# EasyEDA Pro project ProPrj_Micro-Profilometer_2025-09-25.epro, schematic Schematic1
Board Name: Board1; Create Date: 2025-07-30; Page Name: P1; Project Name: 3DOFPlatform; Schematic Name: Schematic1; Update Date: 2025-07-30; Company: 嘉立创EDA; Page Size: A3; Version: V1.0
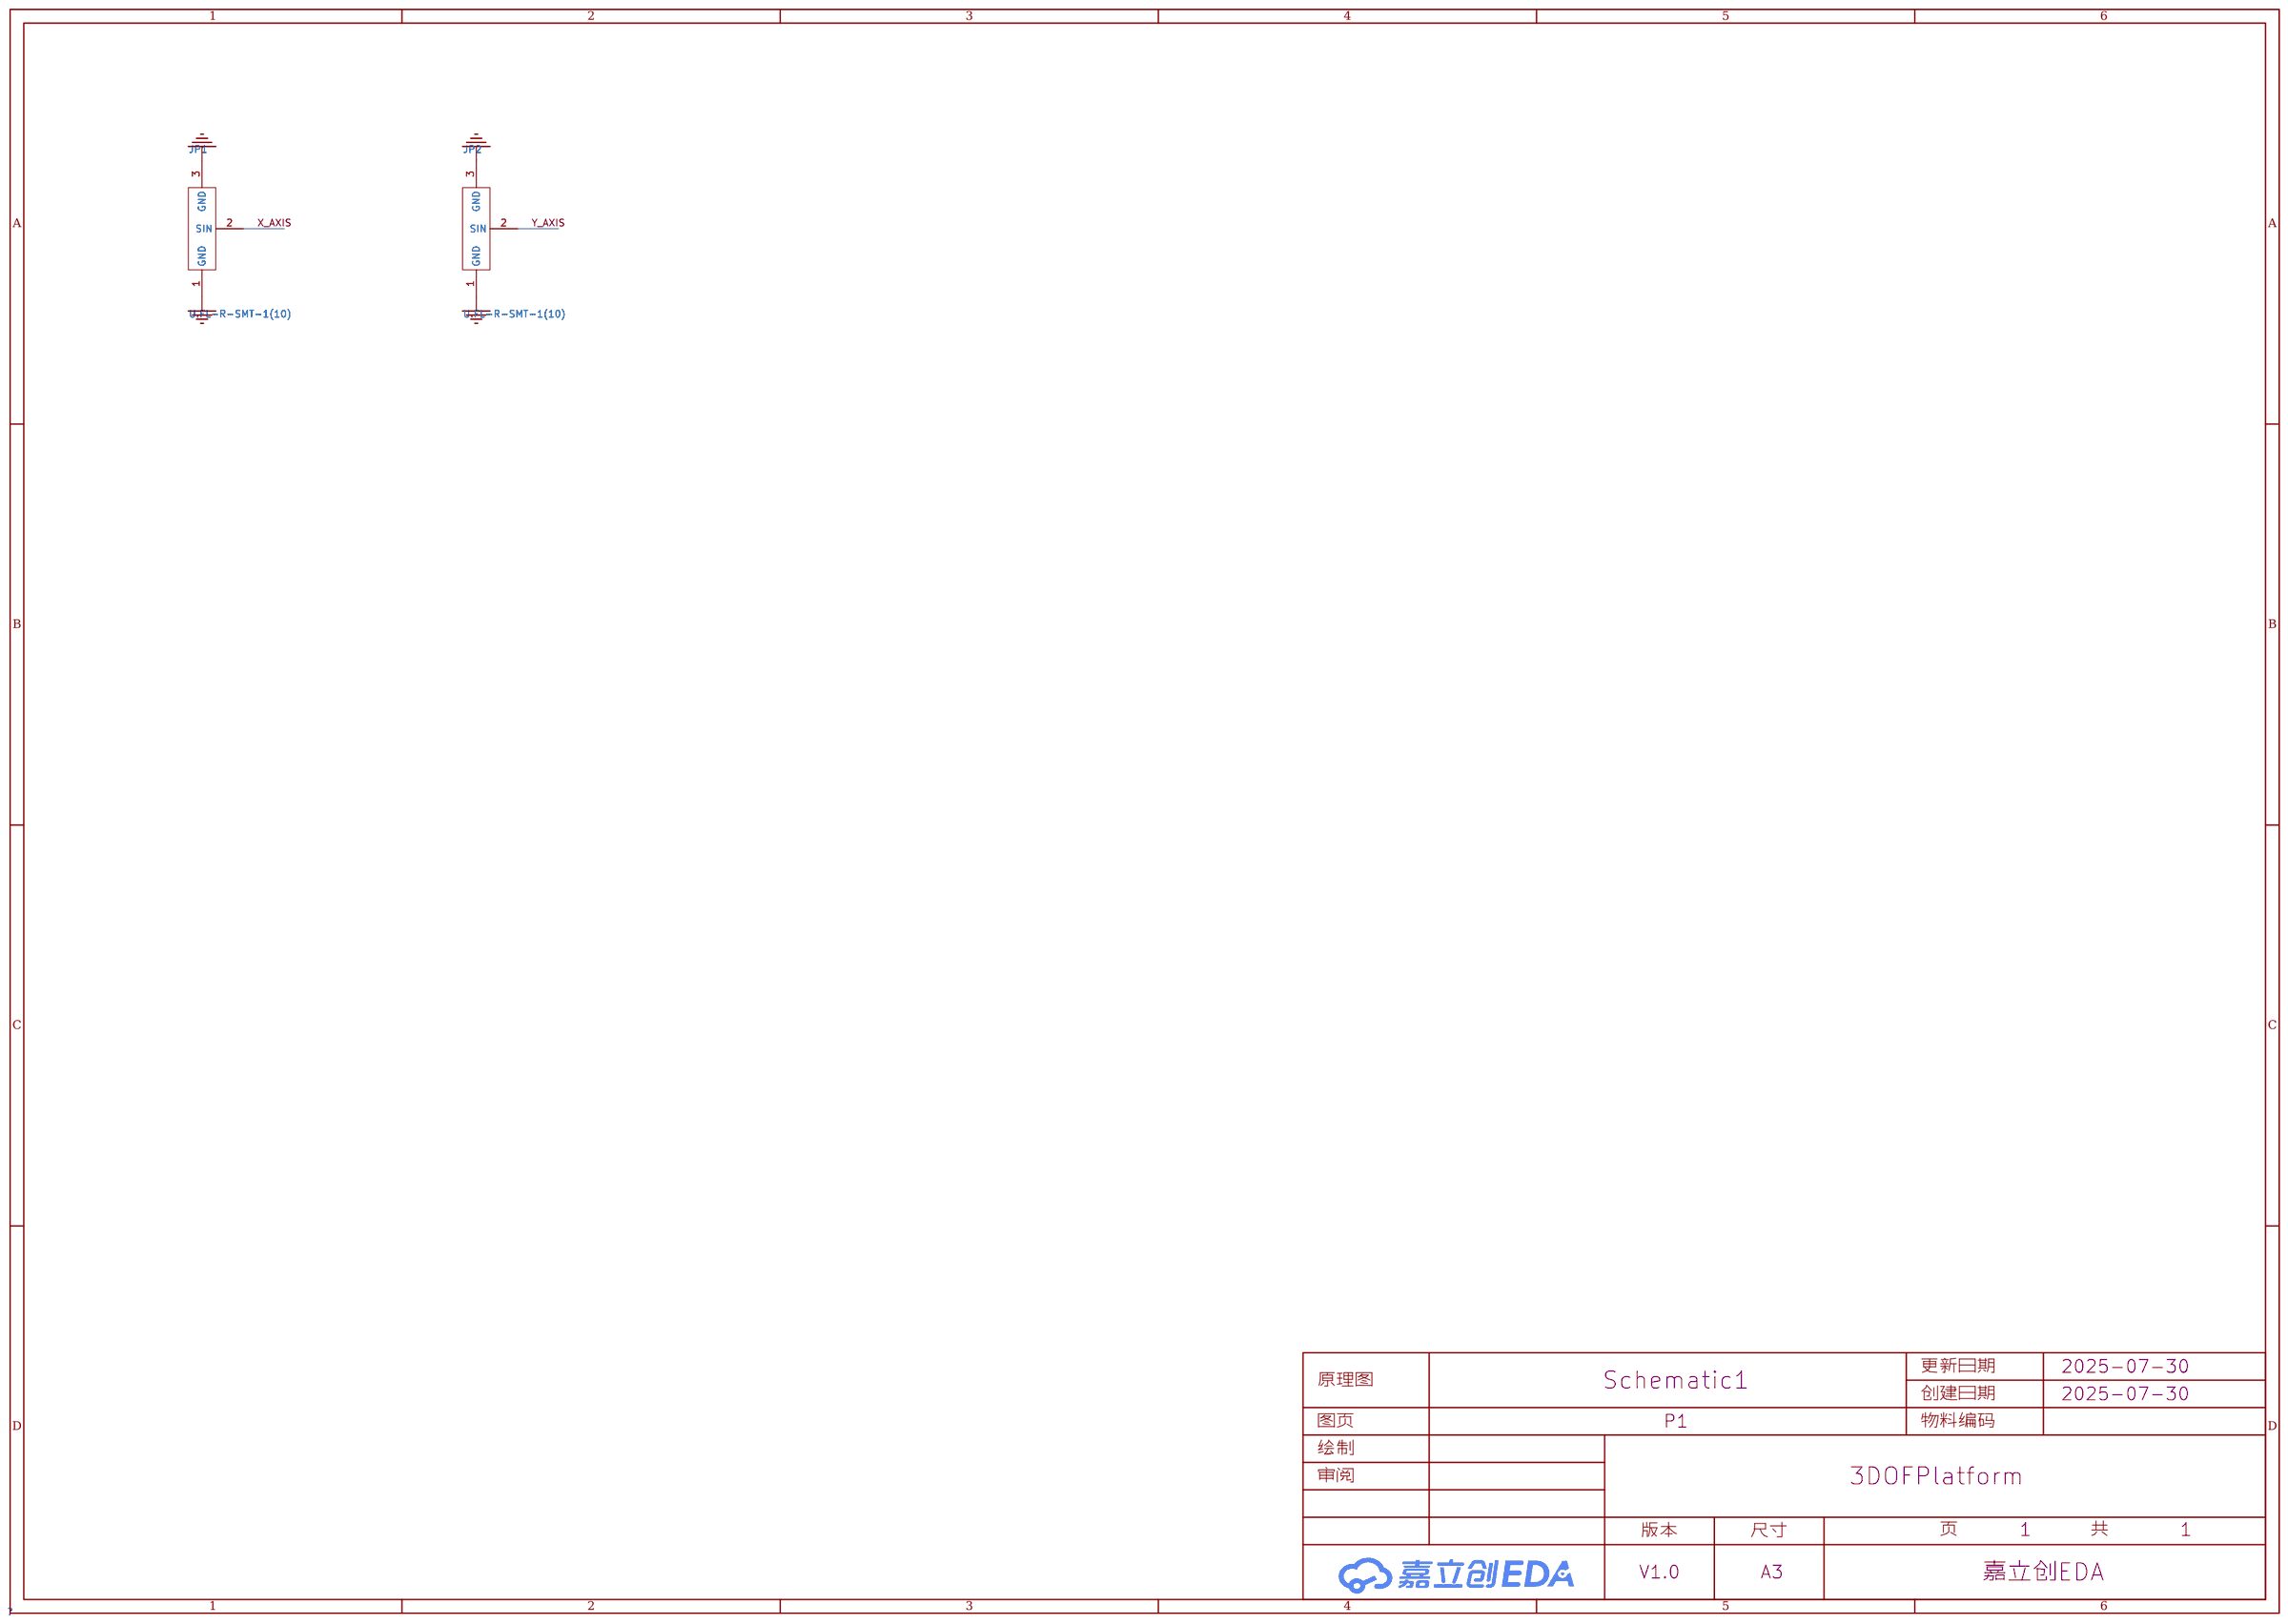
[diagram p2: schematic sheet]

## Parts
JP1  U.FL-R-SMT-1(10)  [ANT-SMD_UFL-R-SMT-1-10]
JP2  U.FL-R-SMT-1(10)  [ANT-SMD_UFL-R-SMT-1-10]

## Library data of the parts
JP1 JP2 = U.FL-R-SMT-1(10): 连接器类型:板端;接口类型:内针;端口数量:1;接口直径:2mm;接口长度/高度:1.25mm;频率-最大值:6GHz;射频系列:IPEX;阻抗:50Ω;样式:-;触头材质:黄铜;工作温度范围:-40℃~+90℃;; LCSC Part Name: IPEX 内针; Supplier Part: C88373; Manufacturer: HRS(广濑); Supplier Footprint: SMD; JLCPCB Part Class: 扩展库; Datasheet: https://atta.szlcsc.com/upload/public/pdf/source/20191010/C434816_11DAC26C7ED37A2D3E584E7DBDF6972E.pdf; Supplier: LCSC; Connector Type: 板端; Interface Type: 内针; Number of Ports: 1; Interface Diameter: 2mm; Interface Length/Height: 1.25mm; Frequency-Max: 6GHz; RF Series: IPEX; Impedance: 50Ω; Contact Material: 黄铜; Operating Temperature Range: -40℃~+90℃

## Nets
GND: JP1.1(GND) JP1.3(GND) JP2.1(GND) JP2.3(GND)
X_AXIS: JP1.2(SIN)
Y_AXIS: JP2.2(SIN)
